# Altium schematic sheet LED_PROJECT.SchDoc
size Letter
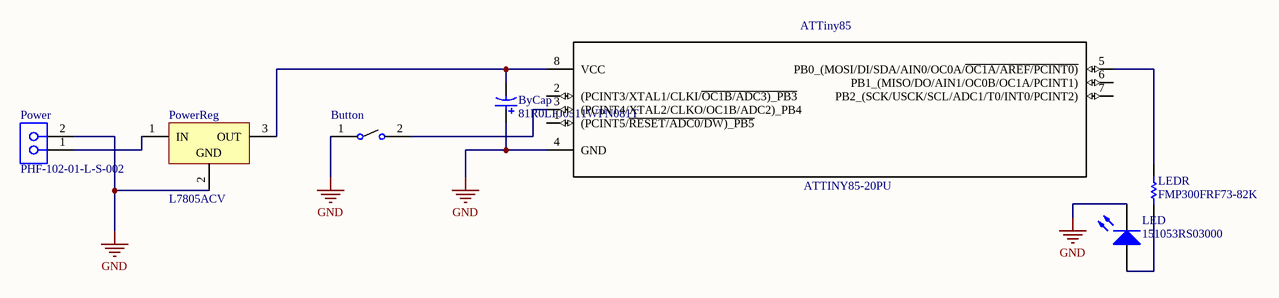
[diagram p0: LED_PROJECT.SchDoc]

## Parts
ATTiny85  ATTINY85-20PU  [DIP254P762X533-8]
Button  147694-1  [TE_FSM8JRT]  (value not drawn)
ByCap  81R0LFJ0511WPN081T  [FHTE-8-0511-2_M]
LED  151053RS03000  [Type 5mm]
LEDR  FMP300FRF73-82K  [YAGO-FMP300-2_V2]
Power  PHF-102-01-L-S-002  [SMTC-PHF-102-01-X-S-002]
PowerReg  L7805ACV  [TO220]

## Nets
GND: ATTiny85.4(GND) Button.1 ByCap.1 LED.1(K) Power.2 PowerReg.2(GND)
NetATTiny85_3: ATTiny85.3((PCINT4/XTAL2/CLKO/OC1B/ADC2)_PB4) Button.2
NetATTiny85_5: ATTiny85.5(PB0_(MOSI/DI/SDA/AIN0/OC0A/~{OC1A/AREF/PCINT0)}) LEDR.2
NetATTiny85_8: ATTiny85.8(VCC) ByCap.2 PowerReg.3(OUT)
NetLED_2: LED.2(A) LEDR.1
NetPower_1: Power.1 PowerReg.1(IN)

Not connected (* = marked no-connect by the designer): ATTiny85 1((PCINT5/~{RESET/ADC0/DW)_PB5}) 2((PCINT3/XTAL1/CLKI/~{OC1B/ADC3)_PB3}) 6(PB1_(MISO/DO/AIN1/OC0B/OC1A/PCINT1)) 7(PB2_(SCK/USCK/SCL/ADC1/T0/INT0/PCINT2))

## Library data of the parts
ATTiny85 = ATTINY85-20PU: ATtiny Series 20 MHz 8 KB Flash 512 B SRAM 8-Bit Microcontroller - DIP-8; MF: Microchip; Price: None; SnapEDA_Link: https://www.snapeda.com/parts/ATTINY85-20PU/Microchip/view-part/?ref=snap; Availability: Unavailable; MP: ATTINY85-20PU; Package: DIP-8 Microchip; Value: *
Button = FSM8JRT: FSM8JRT=SWITCH,PUSHBUTTON,TACT; Configuration_Pole-Throw: Single Pole - Single Throw; Contact_Current_Rating: 50 mA; MF: TE Connectivity; Package: None; TE_purchase_URL: https://www.te.com/usa-en/product-147694-1.html?te_bu=Cor&te_type=disp&te_campaign=seda_glo_cor-seda-global-disp-prtnr-fy19-seda-model-bom-cta_sma-317_1&elqCampaignId=32493; MP: FSM8JRT; SnapEDA_Link: https://www.snapeda.com/parts/FSM8JRT/TE%20Connectivity%20ALCOSWITCH%20Switches/view-part/?ref=snap; Digi-Key_Purchase_URL: https://www.digikey.com/product-detail/en/te-connectivity-alcoswitch-switches/FSM8JRT/450-2039-1-ND/4146916?utm_source=snapeda&utm_medium=aggregator&utm_campaign=symbol; EU_RoHS_Compliance: Compliant; Digi-Key_Part_Number: 450-2039-1-ND; Value: *
ByCap = CMP-0909-00001-1: Aluminum Electrolytic Capacitor, 1 uF +/- 5%, 50 V, -40 to 105 degC, 2 Pin THD, Dia 5 mm, Body Length 11 mm, Tape and Reel; Manufacturer: Fenghuang Technology; Nominal Capacitance: 1 uF; Seeve Color: Balck; Voltage: 50 V; Tolerance: +/- 5%; PartNumber: 81R0LFJ0511WPN081T; ComponentLink2Description: Datasheet; PackageReference: 8-0511-2; Packing: Tape and Reel; Mounting Technology: Through Hole; PackageDescription: 2-Pin Through Hole Cap, Dia 5 mm, Body Length 11 mm; ComponentLink1Description: Manufacturer URL; ComponentLink2URL: http://218.15.223.226:8089/BusinessProductPdf/ss_20130228152314.pdf; ComponentLink1URL: http://www.fenghua-advanced.com/; DatasheetVersion: Feb-13; Operating Temperature: -40 to 105 degC
LED = CMP-1489-00007-1: THT LED round mono-color waterclear,  WL-TMRW ,Red; Manufacturer: Wuerth Elektronik; PackageReference: Type 5mm; PartNumber: 151053RS03000; ComponentLink1URL: http://www.we-online.com; ComponentLink2Description: Datasheet; Emitting color: Red; ComponentLink2URL: http://katalog.we-online.de/pbs/datasheet/7448042001.pdfhttp://katalog.we-online.de/pbs/datasheet/7448042001.pdfhttp://katalog.we-online.de/pbs/datasheet/7448042001.pdfhttp://katalog.we-online.de/pbs/datasheet/151053RS03000.pdf; ComponentLink1Description: Manufacturer URL
LEDR = CMP-1257-00001-1: Metal Film Resistor, 82 KOhm +/-1%, 3 W, -55 to 155 degC, 2-Pin THD, RoHS, Tape and Reel; Manufacturer: Yageo; Overload Voltage: 1000 V Max.; Rated Power: 3 W; Resistance: 82 KOhm; Working Voltage: 750 V Max.; RoHS: TRUE; Operating Temperature: -55 to 155 degC; Resistance Tolerance: +/-1%; PartNumber: FMP300FRF73-82K; ComponentLink2URL: http://www.yageo.com/documents/recent/Yageo%20LR_FMP_2013.pdf; PackageDescription: 2-Pin Axial Lead, Body 15.5 x 5 mm, Lead Spread 33 mm; ComponentLink1URL: http://www.yageo.com/NewPortal/_en/index.jsp; ComponentLink3Description: Package Specification; ComponentLink3URL: http://www.yageo.com/documents/recent/Yageo%20LR_FMP_2013.pdf; Packing: Tape and Reel; ComponentLink1Description: Manufacturer URL; DatasheetVersion: Apr-13; Mounting Technology: Through Hole; ComponentLink2Description: Datasheet
Power = CMP-1023-00103-1: Press Fit Socket, Through-hole, Vertical, -55 to 125 degC, 2.54 mm Pitch, 2-Pin, Female, RoHS; Manufacturer: Samtec; Pitch: 2.54 mm; Temperature Range: -55 to 125 degC; PackageDescription: .100 Press Fit Socket Assembly; ComponentLink1URL: http://www.samtec.com; ComponentLink1Description: Manufacturer URL; PackageReference: PHF-102-01-X-S-002; Orientation: Vertical; ComponentLink2URL: http://www.samtec.com/documents/webfiles/pdf/phf.pdf; ComponentLink3Description: Package Specification; RoHS: True; DatasheetVersion: F-214; PartNumber: PHF-102-01-L-S-002; ComponentLink2Description: Datasheet; PackageVersion: F, 9/2009; ComponentLink3URL: http://www.samtec.com/documents/webfiles/cpdf/PHF-1XX-XX-X-X-XXX-MKT.pdf; Mounting Technology: Through-hole
PowerReg = CMP-0244-00484-1: Positive Voltage Regulator, 5V, 3-Pin TO-220; DatasheetVersion: 16/11/2011; ComponentLink2Description: Datasheet; ComponentLink3Description: Package Specification; ComponentLink2URL: http://www.st.com/internet/com/TECHNICAL_RESOURCES/TECHNICAL_LITERATURE/DATASHEET/CD00000444.pdf; PackageDescription: TO, Thru-Hole, Vertical, Heatsink Mounted; 3 In-Line Leads; Pitch 2.54 mm; ComponentLink3URL: http://www.st.com/internet/com/TECHNICAL_RESOURCES/TECHNICAL_LITERATURE/PACKAGE_INFORMATION/CD00004649.pdf; PackageReference: TO220; ComponentLink1URL: http://www.st.com; PackageVersion: ver3.0; ComponentLink1Description: Manufacturer URL